# Altium schematic sheet ESIMA E-Meter_LCD.SchDoc: Esima E-Meter LCD- Display
size A3; DrawnBy: Jürgen Merz; Address1: Wilhelm- Schickard- Strasse 10; Address2: 78052 Villingen Schwenningen; Address3: juergen.merz@hsg-imit.de; Address4: Tel. +49 7721 943 138; PhoneNumber: +49 7721 943 138; FaxNumber: +49 7721 943 140
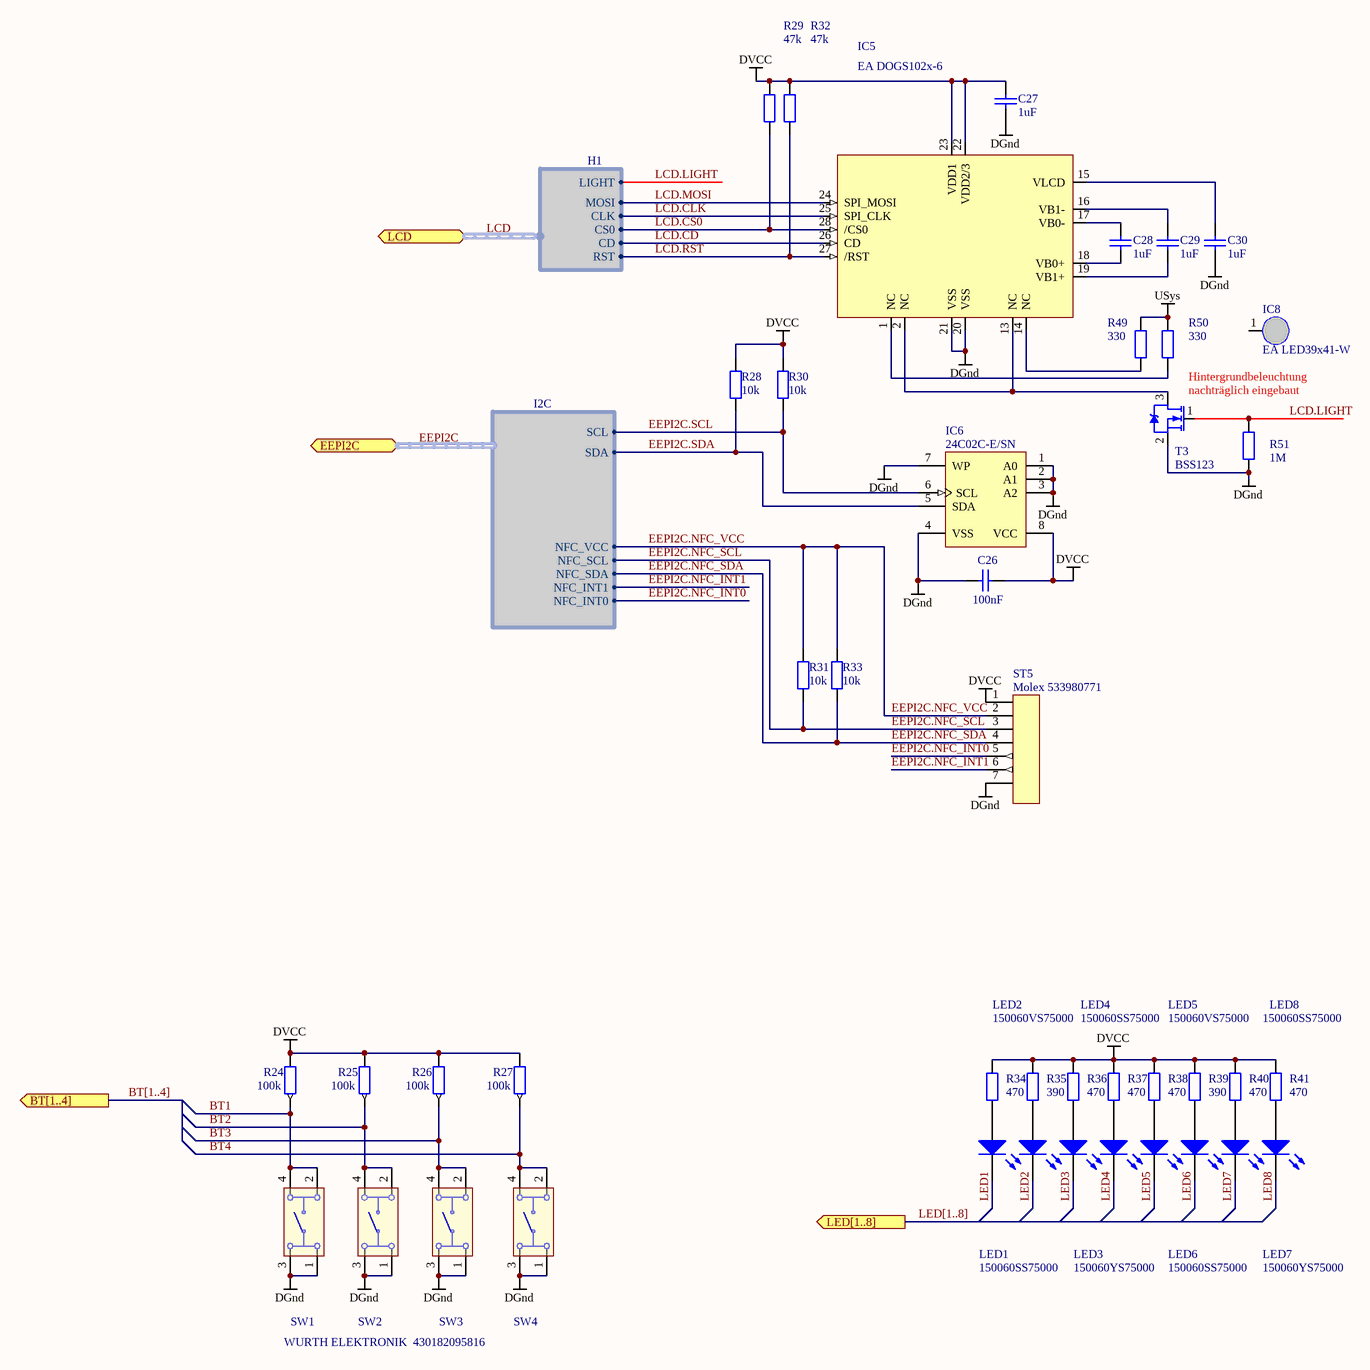
[diagram p0: ESIMA E-Meter_LCD.SchDoc]

## Parts
C26  100nF  [CAPC1608N]
C27  1uF  [CAPC2012N]
C28  1uF  [CAPC2012N]
C29  1uF  [CAPC2012N]
C30  1uF  [CAPC2012N]
IC5  EA DOGS102x-6  [EA DOGS102x-6]
IC6  24C02C-E/SN  [SOIC-SN8_N]
IC8  EA LED39x41-W  (no BOM)
LED1  150060SS75000  [0603]
LED2  150060VS75000  [0603]
LED3  150060YS75000  [0603]
LED4  150060SS75000  [0603]
LED5  150060VS75000  [0603]
LED6  150060SS75000  [0603]
LED7  150060YS75000  [0603]
LED8  150060SS75000  [0603]
R24  100k  [RESC1608N]
R25  100k  [RESC1608N]
R26  100k  [RESC1608N]
R27  100k  [RESC1608N]
R28  10k  [RESC1608N]
R29  47k  [RESC1608N]
R30  10k  [RESC1608N]
R31  10k  [RESC1608N]
R32  47k  [RESC1608N]
R33  10k  [RESC1608N]
R34  470  [RESC1608N]
R35  390  [RESC1608N]
R36  470  [RESC1608N]
R37  470  [RESC1608N]
R38  470  [RESC1608N]
R39  390  [RESC1608N]
R40  470  [RESC1608N]
R41  470  [RESC1608N]
R49  330  [RESC1608N]
R50  330  [RESC1608N]
R51  1M  [RESC1608N]
ST5  Molex 533980771  [Molex 533980771]
SW1  WURTH ELEKTRONIK  430182095816  [430152130826]
SW2  WURTH ELEKTRONIK  430182095816  [430152130826]  (value not drawn)
SW3  WURTH ELEKTRONIK  430182095816  [430152130826]  (value not drawn)
SW4  WURTH ELEKTRONIK  430182095816  [430152130826]  (value not drawn)
T3  BSS123  [SOT23-3N]

## Ports
BT[1..4] (out), EEPI2C (harness I2C), LCD (harness H1), LED[1..8] (out)

## Harnesses
H1: CS0, MOSI, CLK, CD, RST, LIGHT
I2C: SCL, SDA, NFC_INT1, NFC_INT0, NFC_VCC, NFC_SCL, NFC_SDA

## Nets
DGnd: C26.1 C27.1 C30.1 IC5.20(VSS) IC5.21(VSS) IC6.1(A0) IC6.2(A1) IC6.3(A2) IC6.4(VSS) IC6.7(WP) R51.2 ST5.7 SW1.1 SW1.3 SW2.1 SW2.3 SW3.1 SW3.3 SW4.1 SW4.3 T3.2(S)
DVCC: C26.2 C27.2 IC5.22(VDD2/3) IC5.23(VDD1) IC6.8(VCC) R24.2 R25.2 R26.2 R27.2 R28.2 R29.1 R30.2 R32.1 R34.1 R35.1 R36.1 R37.1 R38.1 R39.1 R40.1 R41.1 ST5.1
USys: R49.1 R50.1
BT1: R24.1 SW1.2 SW1.4
BT2: R25.1 SW2.2 SW2.4
BT3: R26.1 SW3.2 SW3.4
BT4: R27.1 SW4.2 SW4.4
EEPI2C.NFC_INT0: ST5.5 ; port EEPI2C.NFC_INT0
EEPI2C.NFC_INT1: ST5.6 ; port EEPI2C.NFC_INT1
EEPI2C.NFC_SCL: R31.1 ST5.3 ; port EEPI2C.NFC_SCL
EEPI2C.NFC_SDA: R33.1 ST5.4 ; port EEPI2C.NFC_SDA
EEPI2C.NFC_VCC: R31.2 R33.2 ST5.2 ; port EEPI2C.NFC_VCC
EEPI2C.SCL: IC6.6(SCL) R30.1 ; port EEPI2C.SCL
EEPI2C.SDA: IC6.5(SDA) R28.1 ; port EEPI2C.SDA
LCD.CD: IC5.26(CD) ; harness H1.CD
LCD.CLK: IC5.25(SPI_CLK) ; harness H1.CLK
LCD.CS0: IC5.28(/CS0) R29.2 ; harness H1.CS0
LCD.LIGHT: R51.1 T3.1(G) ; harness H1.LIGHT
LCD.MOSI: IC5.24(SPI_MOSI) ; harness H1.MOSI
LCD.RST: IC5.27(/RST) R32.2 ; harness H1.RST
LED1: LED1.1(C)
LED2: LED2.1(C)
LED3: LED3.1(C)
LED4: LED4.1(C)
LED5: LED6.1(C)
LED6: LED5.1(C)
LED7: LED7.1(C)
LED8: LED8.1(C)
NetC28_1: C28.1 IC5.18(VB0+)
NetC28_2: C28.2 IC5.17(VB0-)
NetC29_1: C29.1 IC5.19(VB1+)
NetC29_2: C29.2 IC5.16(VB1-)
NetC30_2: C30.2 IC5.15(VLCD)
NetIC5_1: IC5.1(NC) R50.2
NetIC5_2: IC5.2(NC) IC5.13(NC) T3.3(D)
NetIC5_14: IC5.14(NC) R49.2
NetLED1_2: LED1.2(A) R34.2
NetLED2_2: LED2.2(A) R35.2
NetLED3_2: LED3.2(A) R36.2
NetLED4_2: LED4.2(A) R37.2
NetLED5_2: LED5.2(A) R39.2
NetLED6_2: LED6.2(A) R38.2
NetLED7_2: LED7.2(A) R40.2
NetLED8_2: LED8.2(A) R41.2

Not connected (* = marked no-connect by the designer): IC8 1; ST5 8 9

## Buses and harness runs
bus BT[1..4] = port BT[1..4]
bus LED[1..8] = port LED[1..8]
harness EEPI2C = port EEPI2C
harness LCD = port LCD

## Notes on the sheet
- Hintergrundbeleuchtung
- (near T3) nachträglich eingebaut
- Title
- Size:
- Date:
- A3
- Number:
- Time:
- Revision:
- Sheet
- of
- File:

## Library data of the parts
C26 = CAPC1608 (C0603): Supplier 1: Farnell; Supplier Part Number 1: 1657913
C27-C30 = CAPC2012 (C0805)
  C27-C29: Supplier 1: Farnell; Supplier Part Number 1: 9227873RL
IC5 = EA DOGS102x-6: LCD Graphic Display 102*64 Dots SPI-Interface; Supplier 1: Mouser; Supplier Part Number 1: 790-EADOGS102W-6
IC6 = 24C02C-E/SN: 2Kbit, 400kHz, 5V, I2C Serial EEPROM, 8-Pin SOIC 150mil, Extended Temperature; Supplier 1: Farnell; Supplier Part Number 1: 1084339
IC8 = Passmarke 1mm: LCD-Hintergrundbeleuchtung, Part von EA DOGS102x-6; Supplier 1: Mouser; Supplier Part Number 1: 790-EALED39X41-W
LED1 LED4 LED8 = WL-SMCW 0603  150060SS75000: LED, 0603, SUP. ROT, 60MCD, 630NM; Supplier 1: Farnell; Supplier Part Number 1: 2322072
LED2 = WL-SMCW 0603  150060VS75000: LED, 0603, GRÜN, 40MCD, 570NM; Supplier 1: Farnell; Supplier Part Number 1: 2322073
LED3 LED7 = WL-SMCW 0603  150060YS75000: LED, 0603, GELB, 120MCD, 590NM
  LED3: Supplier 1: Farnell; Supplier Part Number 1: 2322074
LED5 = WL-SMCW 0603  150060VS75000: LED, 0603, SUP. ROT, 60MCD, 630NM; Supplier 1: Farnell; Supplier Part Number 1: 2322072
LED6 = WL-SMCW 0603  150060SS75000: LED, 0603, GRÜN, 40MCD, 570NM; Supplier 1: Farnell; Supplier Part Number 1: 2322073
R24-R41 R49-R51 = RESC1608 (R0603)
  R24-R27: Supplier 1: Farnell; Supplier Part Number 1: 1576310
  R28 R30 R31 R33: Supplier 1: Farnell; Supplier Part Number 1: 2008341
  R29 R32 R49-R51: Supplier 1: Farnell; Supplier Part Number 1: 2333548
ST5 = Molex 533980771: Molex Pico 7Pol Blade SMD gerade 533980771; Supplier 1: Farnell; Supplier Part Number 1: 9786368
SW1-SW4 = WE-Tact Switches WS-TASV 430152130826: WS-TASV SMD Tact Switch 6X6 mm; Manufacturer: W¨¹rth Elektronik eiSos GmbH & Co.KG; ComponentLink1 Description: Manufacturer; ComponentLink2 Description: Datasheet; Creat by: Karrer Zheng; NoPins: 04; Creat Date: 28 February 2014; partNo: 430152130826; ComponentLink1URL: http://www.we-online.com; ComponentLink2URL: http://katalog.we-online.de/em/datasheet/4301x2.pdf; Supplier 1: Farnell; Supplier Part Number 1: 2065108
T3 = MOSFET N-Kanal SOT-23: 09_Ersteller: HSG Jürgen Merz; 02_Herstellerbezeichnung: ka; 10_Erstell_Datum: 10.06.2010; Supplier 1: Mouser; Supplier Part Number 1: 512-BSS123L